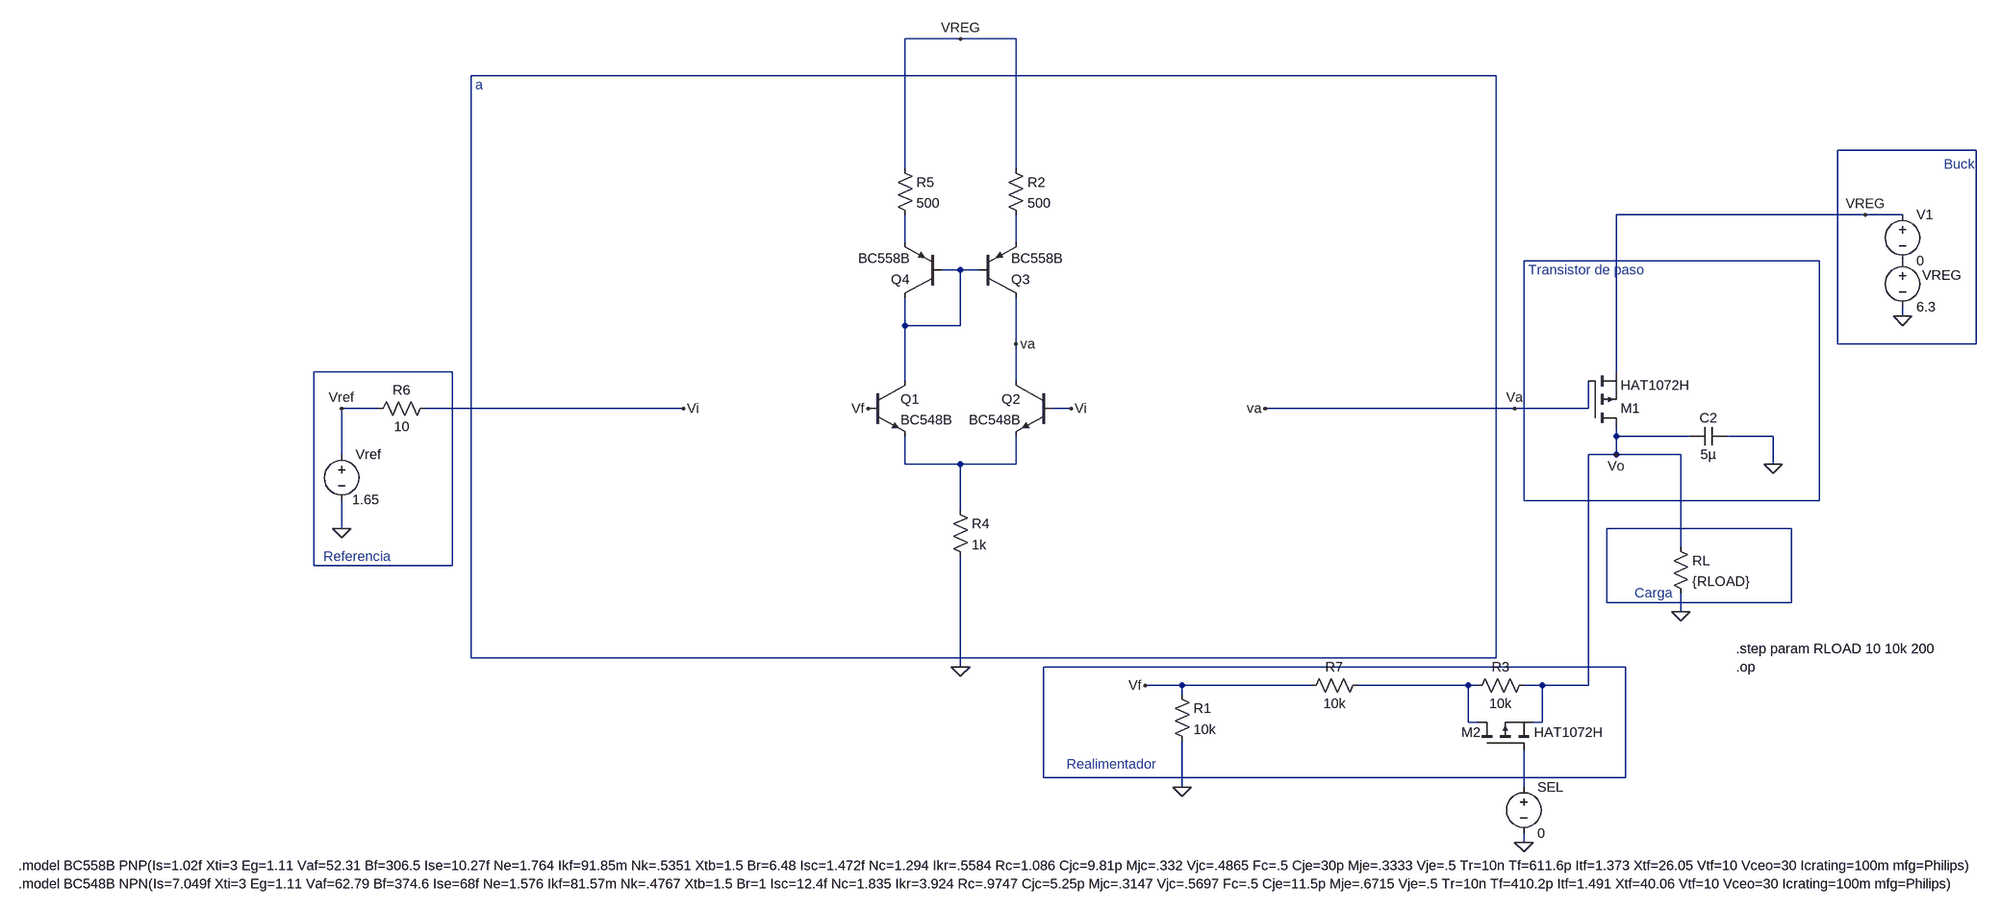
[diagram p0: schematic LDO_PMOSNoReal_SinSumidero.asc]
LDO_PMOSNoReal_SinSumidero.asc, the LTspice schematic file:
Version 4
SHEET 1 2480 952
WIRE 336 -544 240 -544
WIRE 432 -544 336 -544
WIRE 1264 -480 -512 -480
WIRE 2096 -336 1856 -336
WIRE 240 -304 240 -544
WIRE 432 -304 432 -544
WIRE 1904 -224 1472 -224
WIRE 1968 -224 1904 -224
WIRE 240 -176 240 -224
WIRE 432 -176 432 -224
WIRE 1824 -144 1312 -144
WIRE 336 -128 304 -128
WIRE 368 -128 336 -128
WIRE 1968 -48 1968 -64
WIRE 240 -32 240 -80
WIRE 336 -32 336 -128
WIRE 336 -32 240 -32
WIRE 432 0 432 -80
WIRE 1856 0 1856 -336
WIRE 2096 0 2096 -336
WIRE 2096 0 1856 0
WIRE -544 48 -784 48
WIRE 1472 48 1472 -224
WIRE 240 64 240 -32
WIRE 432 64 432 0
WIRE -672 112 -736 112
WIRE -144 112 -592 112
WIRE 528 112 496 112
WIRE 1296 112 864 112
WIRE 1424 112 1424 64
WIRE 1424 112 1296 112
WIRE 1472 160 1472 144
WIRE 1600 160 1472 160
WIRE 1744 160 1664 160
WIRE -736 192 -736 112
WIRE 1472 192 1472 160
WIRE 1472 192 1424 192
WIRE 1584 192 1472 192
WIRE 240 208 240 160
WIRE 336 208 240 208
WIRE 432 208 432 160
WIRE 432 208 336 208
WIRE 1744 208 1744 160
WIRE 1312 272 1312 -144
WIRE 1824 272 1824 -144
WIRE 1824 272 1312 272
WIRE 336 288 336 208
WIRE -736 320 -736 272
WIRE 1776 320 1456 320
WIRE 1584 352 1584 192
WIRE -784 384 -784 48
WIRE -544 384 -544 48
WIRE -544 384 -784 384
WIRE 1456 448 1456 320
WIRE 1776 448 1776 320
WIRE 1776 448 1456 448
WIRE 1584 464 1584 432
WIRE -512 544 -512 -480
WIRE 1264 544 1264 -480
WIRE 1264 544 -512 544
WIRE 336 560 336 368
WIRE 1488 560 480 560
WIRE 720 592 656 592
WIRE 944 592 720 592
WIRE 1216 592 1024 592
WIRE 1232 592 1216 592
WIRE 1344 592 1312 592
WIRE 1424 592 1424 192
WIRE 1424 592 1344 592
WIRE 720 608 720 592
WIRE 1216 656 1216 592
WIRE 1232 656 1216 656
WIRE 1344 656 1344 592
WIRE 1344 656 1328 656
WIRE 480 752 480 560
WIRE 1488 752 1488 560
WIRE 1488 752 480 752
WIRE 720 768 720 688
WIRE 1312 768 1312 704
WIRE 1312 864 1312 848
FLAG 1584 464 0
FLAG -736 320 0
FLAG 1296 112 Va
FLAG -736 112 Vref
FLAG 720 768 0
FLAG 1472 192 Vo
FLAG 1968 -48 0
FLAG 1744 208 0
FLAG 336 560 0
FLAG 656 592 Vf
FLAG 336 -544 VREG
FLAG -144 112 Vi
FLAG 432 0 va
FLAG 864 112 va
FLAG 528 112 Vi
FLAG 176 112 Vf
FLAG 1904 -224 VREG
FLAG 1312 864 0
SYMBOL voltage -736 176 R0
WINDOW 123 0 0 Left 0
WINDOW 39 0 0 Left 0
WINDOW 3 66 94 Right 2
SYMATTR Value 1.65
SYMATTR InstName Vref
SYMBOL res 1568 336 R0
SYMATTR InstName RL
SYMATTR Value {RLOAD}
SYMBOL res 704 592 R0
SYMATTR InstName R1
SYMATTR Value 10k
SYMBOL res 1328 576 R90
WINDOW 0 0 56 VBottom 2
WINDOW 3 32 56 VTop 2
SYMATTR InstName R3
SYMATTR Value 10k
SYMBOL pmos 1424 144 M180
SYMATTR InstName M1
SYMATTR Value HAT1072H
SYMBOL voltage 1968 -160 R0
WINDOW 123 0 0 Left 0
WINDOW 39 0 0 Left 0
WINDOW 0 34 41 Left 2
SYMATTR InstName VREG
SYMATTR Value 6.3
SYMBOL voltage 1968 -240 R0
WINDOW 123 0 0 Left 0
WINDOW 39 0 0 Left 0
SYMATTR InstName V1
SYMATTR Value 0
SYMBOL cap 1664 144 R90
WINDOW 0 0 32 VBottom 2
WINDOW 3 32 32 VTop 2
SYMATTR InstName C2
SYMATTR Value 5µ
SYMBOL npn 176 64 R0
SYMATTR InstName Q1
SYMATTR Value BC548B
SYMBOL npn 496 64 M0
SYMATTR InstName Q2
SYMATTR Value BC548B
SYMBOL res 320 272 R0
SYMATTR InstName R4
SYMATTR Value 1k
SYMBOL pnp 368 -80 M180
SYMATTR InstName Q3
SYMATTR Value BC558B
SYMBOL pnp 304 -80 R180
SYMATTR InstName Q4
SYMATTR Value BC558B
SYMBOL res 416 -320 R0
SYMATTR InstName R2
SYMATTR Value 500
SYMBOL res 224 -320 R0
SYMATTR InstName R5
SYMATTR Value 500
SYMBOL res -576 96 R90
WINDOW 0 0 56 VBottom 2
WINDOW 3 32 56 VTop 2
SYMATTR InstName R6
SYMATTR Value 10
SYMBOL res 1040 576 R90
WINDOW 0 0 56 VBottom 2
WINDOW 3 32 56 VTop 2
SYMATTR InstName R7
SYMATTR Value 10k
SYMBOL pmos 1232 704 R270
WINDOW 0 31 -28 VRight 2
WINDOW 3 31 98 VRight 2
SYMATTR InstName M2
SYMATTR Value HAT1072H
SYMBOL voltage 1312 752 R0
WINDOW 123 0 0 Left 0
WINDOW 39 0 0 Left 0
SYMATTR InstName SEL
SYMATTR Value 0
TEXT -768 368 Left 2 ;Referencia
TEXT 520 728 Left 2 ;Realimentador
TEXT -504 -464 Left 2 ;a
TEXT 1320 -128 Left 2 ;Transistor de paso
TEXT 1504 432 Left 2 ;Carga
TEXT 1680 528 Left 2 !.step param RLOAD 10 10k 200
TEXT -1296 904 Left 2 !.model BC558B PNP(Is=1.02f Xti=3 Eg=1.11 Vaf=52.31 Bf=306.5 Ise=10.27f Ne=1.764 Ikf=91.85m Nk=.5351 Xtb=1.5 Br=6.48 Isc=1.472f Nc=1.294 Ikr=.5584 Rc=1.086 Cjc=9.81p Mjc=.332 Vjc=.4865 Fc=.5 Cje=30p Mje=.3333 Vje=.5 Tr=10n Tf=611.6p Itf=1.373 Xtf=26.05 Vtf=10 Vceo=30 Icrating=100m mfg=Philips)
TEXT -1296 936 Left 2 !.model BC548B NPN(Is=7.049f Xti=3 Eg=1.11 Vaf=62.79 Bf=374.6 Ise=68f Ne=1.576 Ikf=81.57m Nk=.4767 Xtb=1.5 Br=1 Isc=12.4f Nc=1.835 Ikr=3.924 Rc=.9747 Cjc=5.25p Mjc=.3147 Vjc=.5697 Fc=.5 Cje=11.5p Mje=.6715 Vje=.5 Tr=10n Tf=410.2p Itf=1.491 Xtf=40.06 Vtf=10 Vceo=30 Icrating=100m mfg=Philips)
TEXT 1680 560 Left 2 !.op
TEXT 2040 -312 Left 2 ;Buck

The netlist it stands for:
* LDO_PMOSNoReal_SinSumidero.asc
Vref Vref 0 1.65
RL Vo 0 {RLOAD}
R1 Vf 0 10k
R3 Vo N011 10k
M1 Vo Va VREG VREG HAT1072H
VREG P001 0 6.3
V1 VREG P001 0
C2 0 Vo 5µ
Q1 N006 Vf N008 0 BC548B
Q2 Va Vi N008 0 BC548B
R4 N008 0 1k
Q3 Va N006 N004 0 BC558B
Q4 N006 N006 N003 0 BC558B
R2 VREG N004 500
R5 VREG N003 500
R6 Vi Vref 10
R7 N011 Vf 10k
M2 N011 N012 Vo Vo HAT1072H
V§SEL N012 0 0
.model NPN NPN
.model PNP PNP
.lib standard.bjt
.model NMOS NMOS
.model PMOS PMOS
.lib standard.mos
* Referencia
* Realimentador
* a
* Transistor de paso
* Carga
.step param RLOAD 10 10k 200
.model BC558B PNP(Is=1.02f Xti=3 Eg=1.11 Vaf=52.31 Bf=306.5 Ise=10.27f Ne=1.764 Ikf=91.85m Nk=.5351 Xtb=1.5 Br=6.48 Isc=1.472f Nc=1.294 Ikr=.5584 Rc=1.086 Cjc=9.81p Mjc=.332 Vjc=.4865 Fc=.5 Cje=30p Mje=.3333 Vje=.5 Tr=10n Tf=611.6p Itf=1.373 Xtf=26.05 Vtf=10 Vceo=30 Icrating=100m mfg=Philips)
.model BC548B NPN(Is=7.049f Xti=3 Eg=1.11 Vaf=62.79 Bf=374.6 Ise=68f Ne=1.576 Ikf=81.57m Nk=.4767 Xtb=1.5 Br=1 Isc=12.4f Nc=1.835 Ikr=3.924 Rc=.9747 Cjc=5.25p Mjc=.3147 Vjc=.5697 Fc=.5 Cje=11.5p Mje=.6715 Vje=.5 Tr=10n Tf=410.2p Itf=1.491 Xtf=40.06 Vtf=10 Vceo=30 Icrating=100m mfg=Philips)
.op
* Buck
.backanno
.end